# EAGLE design MJ808 clone - all driver - 23mm (EAGLE 9.4.0)
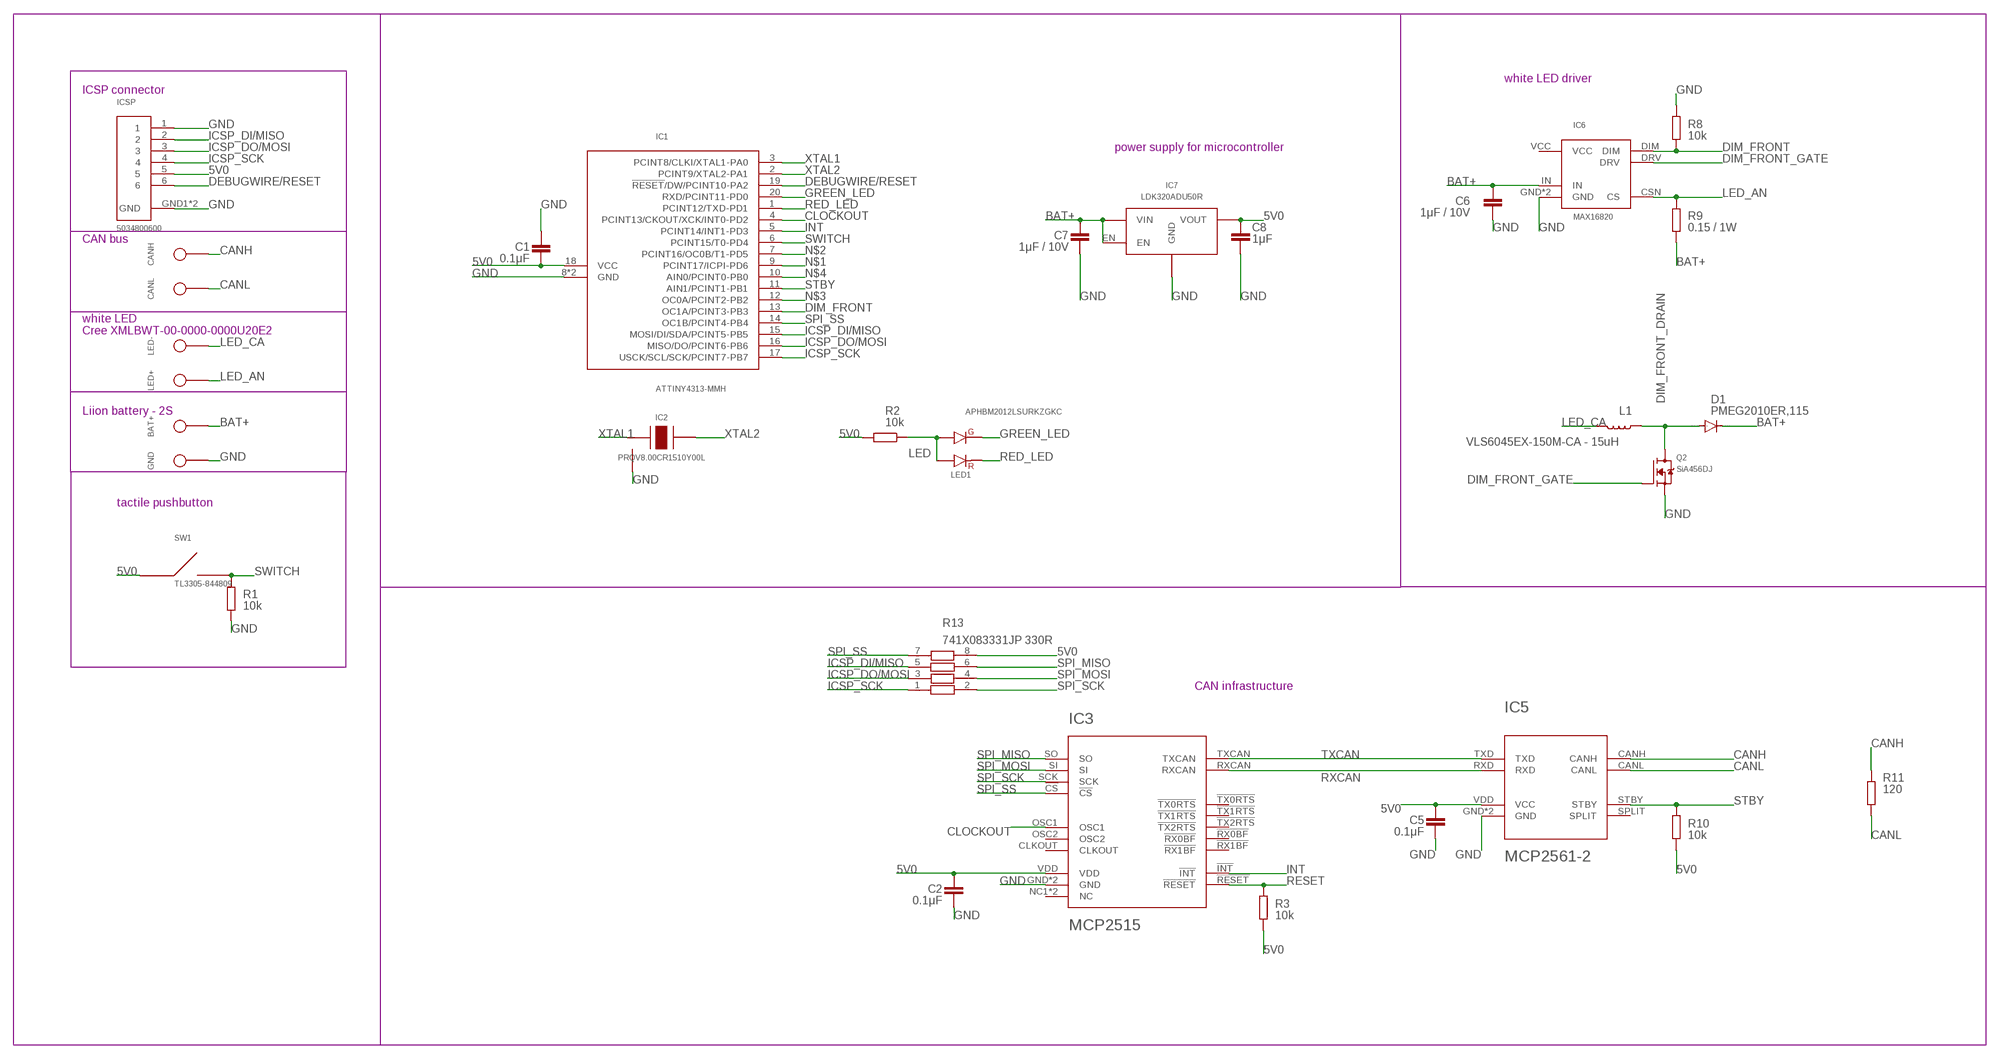
[diagram p0: schematic, sheet 1]

## Parts
BAT+  LiIon + Terminal  TP  [TH]
C1  0.1μF  C-EUC0402  [C0402]
C2  0.1μF  C-EUC0402  [C0402]
C5  0.1μF  C-EUC0402  [C0402]
C6  1μF / 10V  C-EUC0402  [C0402]
C7  1μF / 10V  C-EUC0402  [C0402]
C8  1μF  C-EUC0402  [C0402]
CANH  CAN high  TP  [TH]
CANL  CAN low  TP  [TH]
D1  PMEG2010ER,115  DIODE-SOD123  [SOD123]
GND  LiIon - Terminal  TP  [TH]
IC1  ATTINY4313-MMH  ATTINY4313VQFN-20  [VQFN-20]
IC2  PRQV8.00CR1510Y00L  PRQV  [SMT]
IC3  MCP2515  MCP2515-I-ML  [QFN20]
IC5  MCP2561-2  [DFN10]
IC6  MAX16820  [TDFN-6-EP]
IC7  LDK320ADU50R  LDK320SOT-23-5L  [SOT-23-5L]
ICSP  5034800600  5034800600  [SMT]
L1  VLS6045EX-150M-CA - 15uH  INDUCTOR-SRN6045-33UH  [SRN6045]
LED1  APHBM2012LSURKZGKC  [SMD]
LED+  LED anode  TP  [TH]
LED-  LED cathode  TP  [TH]
Q2  SiA456DJ  SIA456DJ  [SC-70-6]
R1  10k  R-EU_R0402  [R0402]
R2  10k  R-EU_R0402  [R0402]
R3  10k  R-EU_R0402  [R0402]
R8  10k  R-EU_R0402  [R0402]
R9  0.15 / 1W  R-EU_R1210  [R1210]
R10  10k  R-EU_R0402  [R0402]
R11  120  R-EU_R0805  [R0805]
R13  741X083331JP 330R  741X083331JP  [0402]
SW1  TL3305-844809  [SMD]

## Nets
5V0 [VCC]: C1.1 C2.1 C5.1 C8.2 IC1.18(VCC) IC3.VDD IC5.VDD(VCC) IC7.OUT(VOUT) ICSP.5 R2.2 R3.1 R10.1 R13.8 SW1.1 SW1.2
BAT+: BAT+.TP$1 C6.1 C7.1 D1.C IC6.IN IC7.EN IC7.IN(VIN) R9.2
CANH [signal]: CANH.TP$1 IC5.CANH R11.2
CANL [signal]: CANL.TP$1 IC5.CANL R11.1
CLOCKOUT [signal]: IC1.4(PCINT13/CKOUT/XCK/INT0-PD2) IC3.OSC1
DEBUGWIRE/RESET [signal]: IC1.19(!RESET!/DW/PCINT10-PA2) ICSP.6
DIM_FRONT [signal]: IC1.13(OC1A/PCINT3-PB3) IC6.DIM R8.1
DIM_FRONT_DRAIN: D1.A L1.1 Q2.1D(D) Q2.2D(D) Q2.5D(D) Q2.6D(D) Q2.D
DIM_FRONT_GATE [signal]: IC6.DRV Q2.3G(G)
GND: C1.2 C2.2 C5.2 C6.2 C7.2 C8.1 GND.TP$1 IC1.8(GND) IC1.GND IC2.GND IC3.GND IC3.GND6(GND) IC5.GND IC5.VSS(GND) IC6.GND IC6.GND1(GND) IC7.GND ICSP.1 ICSP.GND1(GND) ICSP.GND2(GND) Q2.4S(S) Q2.S R1.2 R8.2
GREEN_LED [signal]: IC1.20(RXD/PCINT11-PD0) LED1.3
ICSP_DI/MISO [signal]: IC1.15(MOSI/DI/SDA/PCINT5-PB5) ICSP.2 R13.5
ICSP_DO/MOSI [signal]: IC1.16(MISO/DO/PCINT6-PB6) ICSP.3 R13.3
ICSP_SCK [signal]: IC1.17(USCK/SCL/SCK/PCINT7-PB7) ICSP.4 R13.1
INT [signal]: IC1.5(PCINT14/INT1-PD3) IC3.!INT!
LED [signal]: LED1.1 LED1.4 R2.1
LED_AN: IC6.CSN(CS) LED+.TP$1 R9.1
LED_CA: L1.2 LED-.TP$1
N$1: IC1.9(PCINT17/ICPI-PD6)
N$2: IC1.7(PCINT16/OC0B/T1-PD5)
N$3: IC1.12(OC0A/PCINT2-PB2)
N$4: IC1.10(AIN0/PCINT0-PB0)
RED_LED [signal]: IC1.1(PCINT12/TXD-PD1) LED1.2
RESET [signal]: IC3.!RESET! R3.2
RXCAN: IC3.RXCAN IC5.RXD
SPI_MISO: IC3.SO R13.6
SPI_MOSI: IC3.SI R13.4
SPI_SCK: IC3.SCK R13.2
SPI_SS [signal]: IC1.14(OC1B/PCINT4-PB4) IC3.!CS! R13.7
STBY [signal]: IC1.11(AIN1/PCINT1-PB1) IC5.STBY R10.2
SWITCH [signal]: IC1.6(PCINT15/T0-PD4) R1.1 SW1.3 SW1.4
TXCAN: IC3.TXCAN IC5.TXD
XTAL1 [signal]: IC1.3(PCINT8/CLKI/XTAL1-PA0) IC2.XTAL1
XTAL2 [signal]: IC1.2(PCINT9/XTAL2-PA1) IC2.XTAL2
Unconnected: IC3.!RX0BF! IC3.!RX1BF! IC3.!TX0RTS! IC3.!TX1RTS! IC3.!TX2RTS! IC3.CLKOUT IC3.NC1(NC) IC3.NC2(NC) IC3.OSC2 IC5.SPLIT

## Notes on the sheet
- white LED driver
- ICSP connector
- power supply for microcontroller
- CAN bus
- white LED
  Cree XMLBWT-00-0000-0000U20E2
- Liion battery - 2S
- tactile pushbutton
- CAN infrastructure

## Power pins joined to a net without a drawn wire
VCC: IC6.VCC

## Library data of the parts
BAT+ CANH CANL GND LED+ LED- = signal testpoint:TP
C1 C2 C5-C8 = rcl:C-EU: CAPACITOR, European symbol; SPICEPREFIX: C
D1 = diode:DIODE-: DIODE
IC1 = ATtiny4313 microcontroller:ATTINY4313; SPICEPREFIX: X
IC2 = PRQV8.00CR1510Y00L - 8MHz resonator:PRQV
IC3 = MCP2515-I-ML - Standalonce CAN Controller with SPI Interface:MCP2515-I-ML
IC5 = MCP2561-2 - High-Speed CAN Transceiver:MCP2561-2
IC6 = MAX16820 LED Driver, constant current:MAX16820
IC7 = LDK320 5V LDO:LDK320
ICSP = 5034800600 FPC Connector:5034800600
L1 = SparkFun-Coils:INDUCTOR: Inductors Resist changes in electrical current. Basically a coil of wire. SparkFun Products: SparkFun Load Cell Amplifier - HX711 <https://www.sparkfun.com/products/13879> IOIO-OTG - V2.2 <https://www.sparkfun.com/products/13613>; PROD_ID: NDUC-11627; VALUE: 33µH/±20%/1.4A
LED1 = APHBM2012LSURKZGKC:APHBM2012LSURKZGKC
Q2 = SIA456DJ-T1-GE3  N-Fet:SIA456DJ
R1-R3 R8-R11 = rcl:R-EU_: RESISTOR, European symbol; SPICEPREFIX: R
R13 = 74x-1133528 Resistor Array:741X083331JP
SW1 = TL3305-844809 SPST-NO Tact Switch:TL3305-844809

## Net classes
0 GND: width 0.254 mm, drill 0.254 mm, clearance 0.127 mm
1 VCC: width 0.254 mm, drill 0.254 mm, clearance 0.127 mm
2 signal: width 0.127 mm, drill 0.254 mm, clearance 0.127 mm
4 5V0_μC: width 0.25 mm, drill 0.25 mm, clearance 0.2 mm
5 currett-0.45: width 0.45 mm, drill 0.35 mm, clearance 0.2 mm

## Board
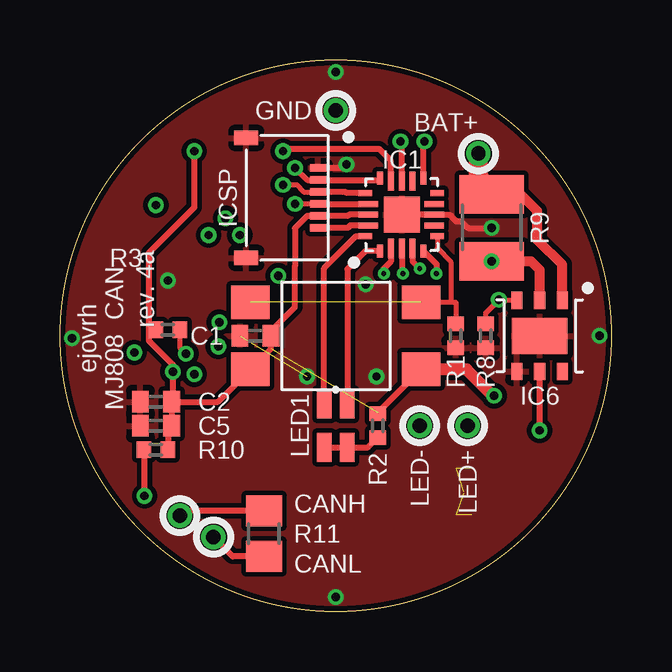
[diagram p1: board, top side]
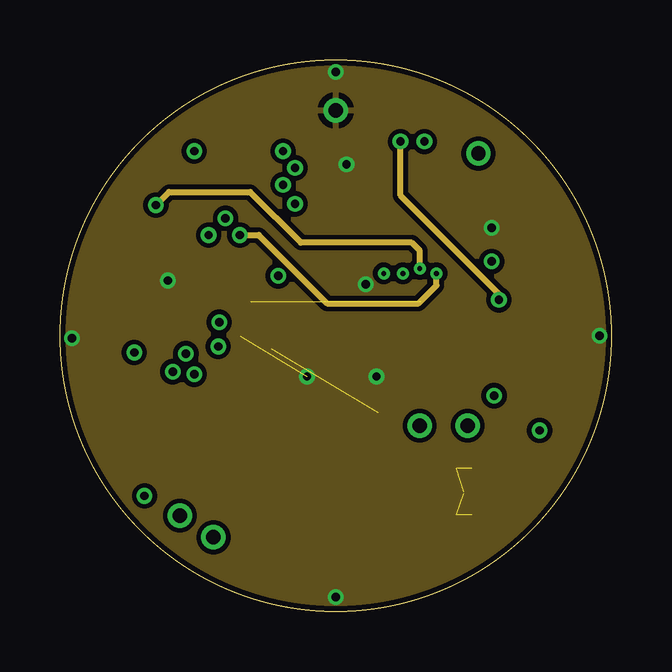
[diagram p2: board, inner layer Route2]
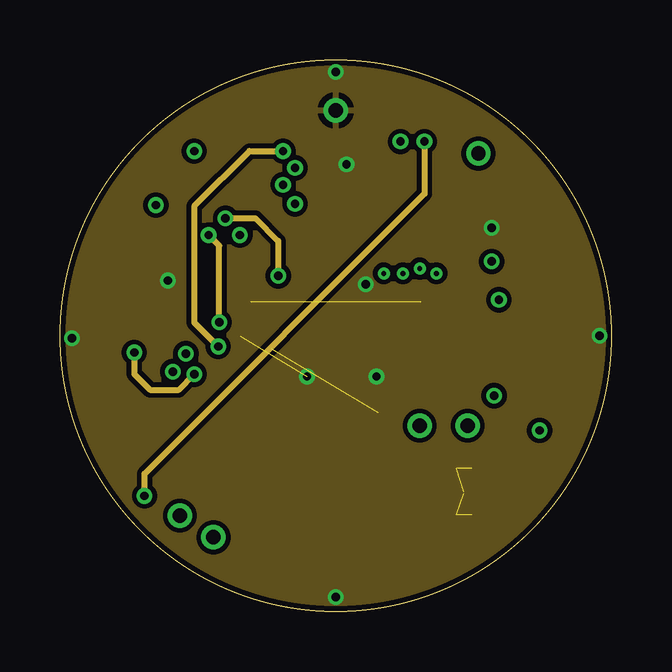
[diagram p3: board, inner layer Route15]
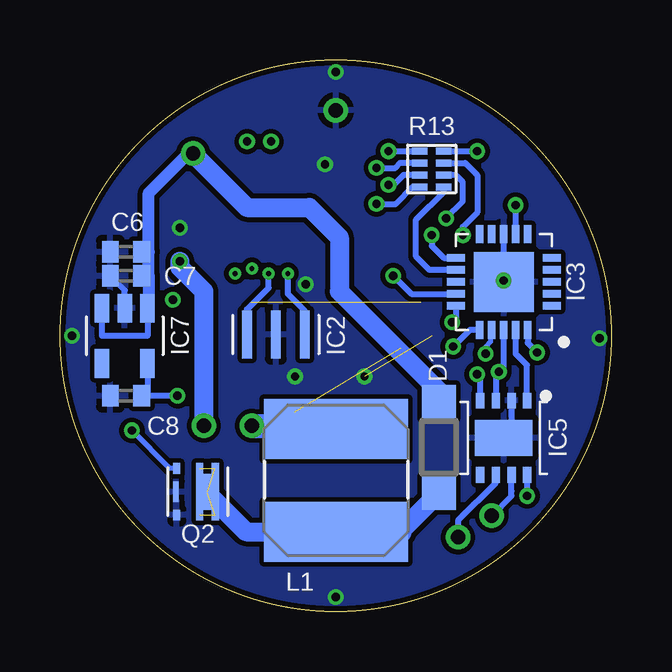
[diagram p4: board, bottom side, seen from below]

Size 23 x 23 mm. Coordinates in mm from the lower left corner, seen from the top.
Outline: circle at 11.5,11.5 radius 11.5
Copper layers (1*16): Top 0.035mm / dielectric 1.5mm / Bottom 0.035mm
Design rules "markovac_2layer *": minimum track width 0.2mm, minimum drill 0.35mm, track to track 0.2mm, track to pad 0.2mm, pad to pad 0.2mm, via to via 0.2mm, smd to smd 0.2mm, copper to edge 0.25mm, drill to drill 8mil, minimum pad ring 0.15mm, minimum via ring 0.15mm, stop-mask expansion 4mil, vias tented up to drill 0.34mm, thermal gap 10mil
tRestrict: area 18.5,10.8 to 18.8,12.2
bRestrict: area 3.5,7.1 to 5.5,7.4

### Footprints (pad centres in the part's own frame; a part is rotated, then mirrored left to right if it is on the bottom)
TH = drill 0.6 pad 1.016: TP$1 0,0
C0402 = smd 0.7 x 0.9: 1 -0.65,0; 2 0.65,0
SOD123 = smd 1.4 x 1.4: A 1.9,0; C -1.9,0
VQFN-20 = smd 0.55 x 0.25: 1 -1.52,0.9; 5 -1.52,-0.9; 11 1.52,-0.9; 15 1.52,0.9 | smd 0.8 x 0.25: 2 -1.4,0.45; 3 -1.4,0; 4 -1.4,-0.45; 12 1.4,-0.45; 13 1.4,0; 14 1.4,0.45 | smd 0.25 x 0.55: 6 -0.9,-1.48; 10 0.9,-1.48; 16 0.9,1.52; 20 -0.9,1.52 | smd 0.25 x 0.8: 7 -0.45,-1.35; 8 0,-1.35; 9 0.45,-1.35; 17 0.45,1.4; 18 0,1.4; 19 -0.45,1.4 | smd 1.5 x 1.5: GND 0,0
SMT = smd 0.4 x 2: GND 0,0; XTAL1 -1.2,0; XTAL2 1.2,0
QFN20 = smd 0.3 x 0.75: !CS! 1,2; !RESET! 0.5,2; !RX0BF! 1,-2; !RX1BF! 0.5,-2; GND6 0,-2; OSC1 -0.5,-2; OSC2 -1,-2; RXCAN -1,2; TXCAN -0.5,2; VDD 0,2 | smd 0.75 x 0.3: !INT! 2,-1; !TX0RTS! -2,0.5; !TX1RTS! -2,0; !TX2RTS! -2,-1; CLKOUT -2,1; NC1 -2,-0.5; NC2 2,0; SCK 2,-0.5; SI 2,0.5; SO 2,1 | smd 2.5 x 2.5: GND 0,0
DFN10 = smd 0.35 x 0.65: CANH -0.325,1.55; CANL 0.325,1.55; RXD 0.975,-1.55; SPLIT 0.975,1.55; STBY -0.975,1.55; TXD -0.975,-1.55; VDD 0.325,-1.55; VSS -0.325,-1.55 | smd 2.4 x 1.5: GND 0,0
TDFN-6-EP = smd 0.71 x 0.46: CSN -1.48,0; DIM -1.48,-0.94; DRV 1.48,0; GND1 1.48,-0.95; IN -1.48,0.94; VCC 1.48,0.95 | smd 1.5 x 2.3: GND 0,0
SOT-23-5L = smd 0.6 x 1.2: ADJ/NC -0.95,-1.15; EN -0.95,1.15; GND 0,1.15; IN 0.95,1.15; OUT 0.95,-1.15
SMT' = smd 0.3 x 0.7: 1 -1.25,1.27; 2 -0.75,1.27; 3 -0.25,1.27; 4 0.25,1.27; 5 0.75,1.27; 6 1.25,1.27 | smd 0.6 x 1: GND1 -2.5,-1.73; GND2 2.5,-1.73
SRN6045 = smd 2.5 x 6: 1 -2.175,0; 2 2.125,0
SMD = smd 1.2 x 0.6: 1 0.9,0.48; 2 -0.9,0.48; 3 -0.9,-0.48; 4 0.9,-0.48
SC-70-6 = smd 0.45 x 0.3: 1D -0.975,0.725; 2D -0.975,0.075; 3G -0.975,-0.88; 4S 0.975,-0.88; 5D 0.975,0.075; 6D 0.975,0.725 | smd 1.5 x 0.95: D 0,0.4 | smd 0.87 x 0.23: S 0,-0.915
R0402 = smd 0.6 x 0.7: 1 -0.5,0; 2 0.5,0
R1210 = smd 1.6 x 2.7: 1 -1.4,0; 2 1.4,0
R0805 = smd 1.3 x 1.5: 1 -0.95,0; 2 0.95,0
0402 = smd 0.65 x 0.3: 1 -0.5,-0.75; 2 0.5,-0.75; 3 -0.5,-0.25; 4 0.5,-0.25; 5 -0.5,0.25; 6 0.5,0.25; 7 -0.5,0.75; 8 0.5,0.75
SMD' = smd 1.6 x 1.4: 1 -3.556,-1.397; 2 3.556,-1.397; 3 -3.556,1.397; 4 3.556,1.397

### Placement (x,y rotation side)
BAT+  17.45,19.1 0 top
C1  8.15,11.5 180 top
C2  4,8.75 180 top
C5  4,7.75 180 top
C6  20.25,15 180 bottom
C7  20.25,14 180 bottom
C8  20.25,9 0 bottom
CANH  5,4 0 top
CANL  6.4,3.1 0 top
D1  7.2,6.85 270 bottom
GND  11.5,20.9 0 top
IC1  14.25,16.55 90 top
IC2  14,11.55 0 bottom
IC3  4.5,13.75 180 bottom
IC5  4.5,7.25 180 bottom
IC6  20,11.5 270 top
IC7  20.3,11.5 0 bottom
ICSP  5034800600  [SMT']  9.5,17.25 270 top
L1  11.5,5.5 90 bottom
LED1  11.5,7.75 270 top
LED+  17,7.75 0 top
LED-  15,7.75 0 top
Q2  17.25,5 270 bottom
R1  16.5,11.5 270 top
R2  13.25,7.75 90 top
R3  4.5,11.75 0 top
R8  17.75,11.5 270 top
R9  18,16 90 top
R10  4,6.75 180 top
R11  8.5,3.25 90 top
R13  7.5,18.45 0 bottom
SW1  TL3305-844809  [SMD']  11.5,11.5 0 top

### Tracks (layer width: path | path; a pad name or v marks a point on that pad's centre or on a via)
5V0  (via drill 0.35)  (1 unrouted)
  Top 0.254: 9.8,14.4 | IC1.18 12.05,16.55 12,16.5 ICSP.5 10.31,16.5 9.8,15.99 9.8,14.4 | 3.7,11.75 3.7,14.95 5.6,16.85 v5.6,19.2 | 3.7,11.75 3.7,11.3 4.7,10.3 v4.7,10 4.7,8.8 C2.1 | SW1.2 13.25,8.3 R2.2 | R10.1 4.5,7.6 C5.1 C2.1 | C2.1 6.59,8.75 SW1.1 8.8,10.96 C1.1 8.8,11.7 9.8,12.7 9.8,14.4 | 3.7,11.75 R3.1
  Top 0.508: SW1.2 16.96,10.1 18.06,9 v18.1,9
  Bottom 0.254: R13.8 v5.6,19.2 | 19.35,9.95 IC7.OUT 19.35,9.05 19.3,9 | v18.1,9 19.3,9 | 19.3,9 C8.2 | IC3.VDD 4.5,10.2 v4.7,10 4.83,9.88 IC5.VDD
BAT+
  Top 0.406: IC6.IN 20.94,14.46 19.9,15.5 19.9,16.7 19.2,17.4 R9.2
  Top 0.8: 17.45,17.95 BAT+.TP$1
  Top 1: R9.2 17.45,17.95
  Bottom 0.254: 17.82,18.93 17.62,18.93 BAT+.TP$1 | IC7.IN 19.35,11.5 21.25,11.5 IC7.EN
  Bottom 0.508: 19.3,14 19.3,12.7 IC7.IN | 19.3,14 19.3,15 | 19.3,15 19.3,17.45 17.82,18.93 | C7.1 19.3,14 | C6.1 19.3,15
  Bottom 0.8: D1.C 7.2,9.2 11.35,13.35 11.35,15.6 12.6,16.85 15.2,16.85 BAT+.TP$1
CANH
  Top 0.254: R11.2 5.2,4.2 CANH.TP$1
  Bottom 0.25: 4.17,5.03 IC5.CANH
  Bottom 0.254: CANH.TP$1 4.17,4.83 4.17,5.03
CANL
  Top 0.254: R11.1 7.2,2.3 CANL.TP$1
  Bottom 0.25: IC5.CANL 4.83,5.38 6.4,3.8 CANL.TP$1
CLOCKOUT  (via drill 0.2, 0.35)
  Top 0.254: v15,14.3 14.7,14.6 IC1.4
  Route2 0.254: v15,14.3 15,15.05 14.67,15.38 10.05,15.38 7.93,17.5 4.55,17.5 v4,16.95
  Bottom 0.254: IC3.OSC1 v4,16.95
DEBUGWIRE/RESET
  Top 0.254: ICSP.6 12,16 12.1,16.1 IC1.19
DIM_FRONT  (via drill 0.35)
  Top 0.2: R8.1 17.75,12.45 v18.3,13 19.04,13 IC6.DIM
  Top 0.25: IC1.13 14.25,19.55 v14.2,19.6
  Route2 0.254: v18.3,13 18.3,13.25 14.2,17.35 v14.2,19.6
DIM_FRONT_DRAIN  (4 unrouted)
  Bottom 0.8: 8.82,3.32 D1.A | L1.1 15.25,3.32 16.85,4.93 Q2.D
  Bottom 1: L1.1 8.82,3.32
DIM_FRONT_GATE  (via drill 0.35)
  Top 0.25: v20,7.55 IC6.DRV
  Bottom 0.2: Q2.3G 18.43,5.97 v20,7.55
GND  (via drill 0.35)  (1 unrouted)
  Top 0.254: v11.95,18.65 11.8,18.5 ICSP.1 | IC1.GND IC1.8 16.25,16.55 16.32,16.48 16.32,16.46 16.52,16.27 16.73,16.27 17,16 v18,16
  Bottom 0.254: IC5.GND 4.17,7.58 IC5.VSS | IC3.GND IC3.GND6 | IC7.GND 20.3,13.4 C7.2
  other vias: 11.5,22.5 0.5,11.4 11.5,0.6 22.5,11.5 13.2,9.8 4.5,13.8 10.3,9.8 12.75,13.65
  pour Route2: -3.5,26.5 26.5,26.5 26.5,-3.5 -3.5,-3.5
  pour Route15: -3.5,26.5 26.5,26.5 26.5,-3.5 -3.5,-3.5
  pour Bottom: -3.5,26.5 26.5,26.5 26.5,-3.5 -3.5,-3.5
  pour Top: -3.5,26.5 26.5,26.5 26.5,-3.5 -3.5,-3.5
GREEN_LED
  Top 0.25: LED1.3 11.02,14.32 | 12.35,15.65 IC1.20
  Top 0.254: 11.02,14.32 12.35,15.65
ICSP_DI/MISO  (via drill 0.35)
  Top 0.2: ICSP.2 10.31,17.99
  Top 0.254: IC1.15 13.28,18 ICSP.2 | ICSP.2 | v9.8,18.5 v9.81,18.5 10.31,17.99 10.32,18 ICSP.2
  Bottom 0.25: 8.81,18.7 9.01,18.5
  Bottom 0.254: v9.8,18.5 9.01,18.5 | R13.5 8.81,18.7
ICSP_DO/MOSI  (via drill 0.35)
  Top 0.2: v9.3,17.8 9.87,17.8 10.16,17.5 ICSP.3
  Top 0.254: ICSP.3 11.9,17.5 11.95,17.45 IC1.16
  Bottom 0.254: R13.3 8.67,18.2 9.07,17.8 v9.3,17.8
ICSP_SCK  (via drill 0.35)
  Top 0.2: ICSP.4 v9.8,17
  Top 0.25: ICSP.4 IC1.17
  Bottom 0.254: v9.8,17 9,17 8.3,17.7 R13.1
INT  (via drill 0.2, 0.35)
  Top 0.254: IC1.5 15.7,14.48 v15.7,14.1
  Route2 0.254: v15.7,14.1 15.7,13.6 14.95,12.85 11.14,12.85 8.29,15.7 v7.5,15.7
  Bottom 0.254: IC3.!INT! 7,14.75 7.5,15.25 v7.5,15.7
LED
  Top 0.25: LED1.4 LED1.1
  Top 0.254: LED1.1 12.85,6.85 R2.1
LED_AN  (via drill 0.35)
  Top 0.406: IC6.CSN 20,14.25 19.65,14.6 R9.1
  Bottom 0.8: R9.1 18,14.35 17,13.35 LED+.TP$1
  other vias: 18,14.6
LED_CA
  Bottom 1: LED-.TP$1 11.62,7.75
  Bottom 1.4: L1.2 11.62,7.75
RED_LED
  Top 0.25: IC1.1 12.73,15.03 11.98,14.28 LED1.2
RESET  (via drill 0.35)
  Top 0.2: v5.25,10.75 5,11 R3.2
  Bottom 0.2: R3.2 5.05,11.7 5.05,11.25 5.25,11.05 v5.25,10.75
RXCAN  (via drill 0.35)
  Route15 0.254: v3.1,10.8 3.1,9.9 3.75,9.25 4.95,9.25 v5.6,9.9
  Bottom 0.254: IC3.RXCAN 3.5,11.2 v3.1,10.8 | IC5.RXD 5.47,9.78 v5.6,9.9
SPI_MISO  (via drill 0.35)
  Route15 0.254: v6.64,12.06 6.64,15.26 v6.2,15.7
  Bottom 0.254: R13.6 6.1,18.7 5.6,18.2 5.6,16.64 6.2,16.04 v6.2,15.7 | IC3.SO 6.5,12.2 v6.64,12.06
SPI_MOSI  (via drill 0.35)
  Route15 0.254: v9.1,14 9.1,15.45 8.15,16.4 v6.9,16.4
  Bottom 0.254: v9.1,14 8.35,13.25 IC3.SI | R13.4 6.5,18.2 6.2,17.9 6.2,17.1 v6.9,16.4
SPI_SCK
  Bottom 0.254: R13.2 7,17.5 8.15,16.35 8.15,14.8 7.6,14.25 IC3.SCK
SPI_SS  (via drill 0.35)
  Top 0.254: IC1.14 13.8,18.8 13.3,19.3 9.4,19.3 v9.3,19.2
  Route15 0.254: v9.3,19.2 7.9,19.2 5.6,16.9 5.6,12.05 v6.6,11.05
  Bottom 0.254: v9.3,19.2 R13.7 | v6.6,11.05 5.9,11.75 IC3.!CS!
STBY  (via drill 0.35)
  Top 0.25: IC1.11 15.15,19.55 v15.2,19.6
  Top 0.254: v3.53,4.83 3.53,6.72 R10.2
  Route15 0.254: v15.2,19.6 15.2,17.42 3.53,5.75 v3.53,4.83
  Bottom 0.254: IC5.STBY v3.53,4.83
SWITCH  (1 unrouted)
  Top 0.2: R1.1 16.5,12.9 16.3,12.9 | IC1.6 15.73,15.15 16.3,14.58 16.3,12.9 | SW1.4 16.3,12.9
TXCAN
  Bottom 0.254: IC5.TXD 3.53,10.28 4,10.75 IC3.TXCAN
XTAL1  (via drill 0.2)
  Top 0.25: IC1.3 14.25,14.15 v14.3,14.1
  Bottom 0.254: v14.3,14.1 14.3,13.5 15.2,12.6 IC2.XTAL1
XTAL2  (via drill 0.2)
  Top 0.25: IC1.2 13.8,14.6
  Top 0.254: 13.8,14.6 13.5,14.3 v13.5,14.1
  Bottom 0.254: v13.5,14.1 13.5,13.25 12.8,12.55 IC2.XTAL2

### Text on the board
tPlace: rev. 4a | ejovrh / MJ808 CAN